# Altium schematic sheet Audio_preAMP.SchDoc
size A
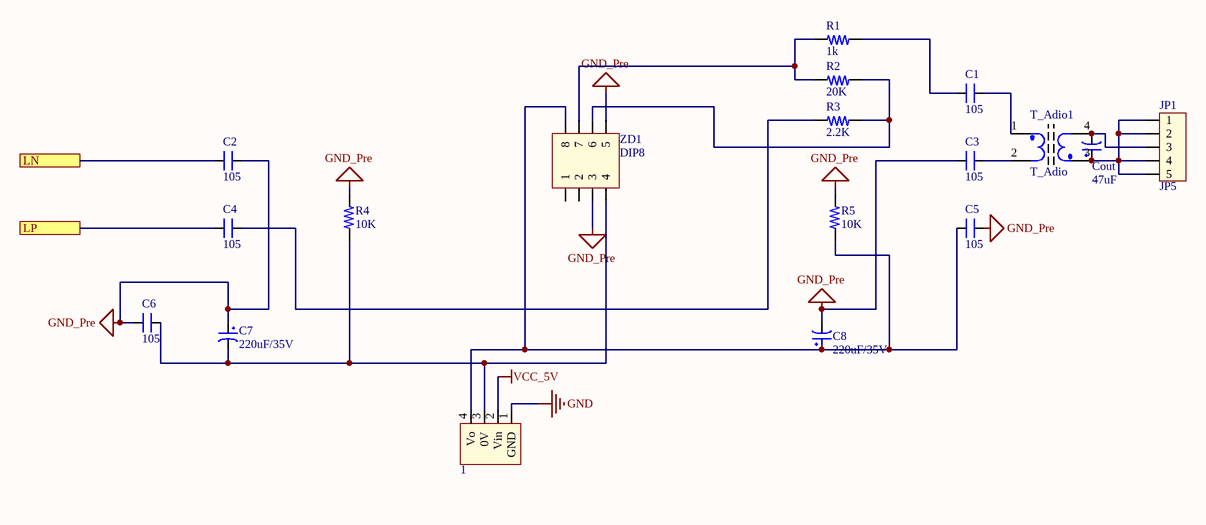
[diagram p0: Audio_preAMP.SchDoc]

## Parts
1  (no value)  [B0505S]
C1  105  [SM-CAP-0805]
C2  105  [SM-CAP-0805]
C3  105  [SM-CAP-0805]
C4  105  [SM-CAP-0805]
C5  105  [SM-CAP-0805]
C6  105  [SM-CAP-0805]
C7  220uF/35V  [CP1.5/3.4]
C8  220uF/35V  [CP1.5/3.4]
Cout  47uF  [CP1/2]
JP1  JP5  [CON5]
R1  1k  [RES_0805 - Dup]
R2  20K  [RES_0805 - Dup]
R3  2.2K  [RES_0805 - Dup]
R4  10K  [RES_0805 - Dup]
R5  10K  [RES_0805 - Dup]
T_Adio1  T_Adio  [T_Adito]
ZD1  DIP8  [DIP8/W0.3]

## Ports
LN, LP

## Nets
GND: 1.1(GND)
GND_Pre: C2.2 C3.1 C5.2 C6.1 C7.1 C8.2 R4.2 R5.2 ZD1.3 ZD1.5
VCC_5V: 1.2(Vin)
LN: C2.1 ; port LN
LP: C4.1 ; port LP
Net1_3: 1.3(0V) C6.2 C7.2 R4.1 ZD1.4
Net1_4: 1.4(Vo) C5.1 C8.1 R5.1 ZD1.8
NetC1_1: C1.1 R1.1
NetC1_2: C1.2 T_Adio1.1
NetC3_2: C3.2 T_Adio1.2
NetC4_2: C4.2 R3.2
NetCout_1: Cout.1 JP1.1 JP1.2 JP1.4 JP1.5 T_Adio1.3
NetCout_2: Cout.2 JP1.3 T_Adio1.4
NetR1_2: R1.2 R2.2 ZD1.7
NetR2_1: R2.1 R3.1 ZD1.6

Not connected (* = marked no-connect by the designer): ZD1 1 2

## Library data of the parts
1 = B0505S: 5V to 5V
C1-C6 = CN: Value: 0,1uF/300V; Designed by: VanDungEvn
C7 C8 = CP3: Cap 100uF/35V - 470uF/16V; Value: 100uF/35V/50V; Description 1: 1000uF/6,3V - 470uF/16V - 330uF - 25V; Description 2: 220uF/35V - 100uF/50V - 63V - 4,7uF/200V; Description 3: 22uF => 33uF100V - 3,3uF => 4,7uF/250V; Description 4: 2,2uF =>3,3uF/350 - 2,2uF/400V - 1uF/450V
Cout = CP1: Cap P  0,1uF < 22uF , 16 - 50V; Value: 10uF/50V; Description 1: 10 => 220uF/6,3V/10V - 10uF => 100uF/16V; Description 2: 0,1uF => 33uF/50V - 10uF => 22uF/63V; Description 3: 0,47uF => 10uF/100V
JP1 = Con5: Connector 5; Value: Connector 5
R1-R5 = RES_10K: Resistor 10K value Chip Resistor 0805 Moisture Resistant Thick Film; Manufacturer: 垈㎵á; Manufacturer Part Number: RC0805FR-071KL; Case/Package: 0805; Supplier-1: Digikey; Supplier Part Number-1: 311-1.00KCRCT-ND
T_Adio1 = T_Adio: Transformer Audio; Designed by: VanDungEvn; Value: BAX
ZD1 = DIP8: Value: DIP8